# EAGLE design vusbtiny (EAGLE 6.4)
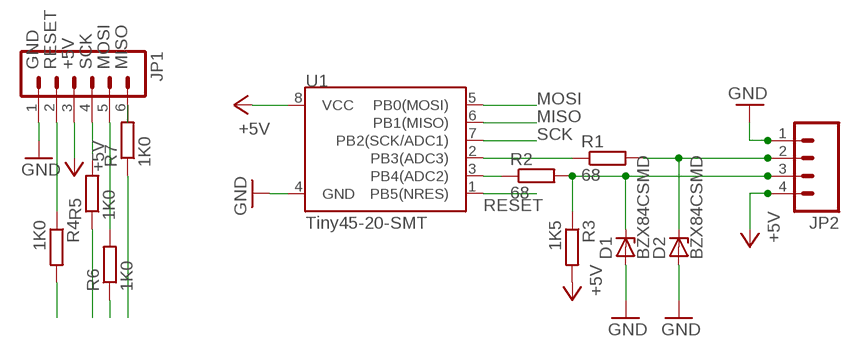
[diagram p0: schematic, sheet 1]

## Parts
D1  BZX84CSMD  [TO236]
D2  BZX84CSMD  [TO236]
JP1  M06LONGPADS  [1X06_LONGPADS]
JP2  M04LONGPADS  [1X04_LONGPADS]
R1  68  R-EU_R0805  [R0805]
R2  68  R-EU_R0805  [R0805]
R3  1K5  R-EU_R0805  [R0805]
R4  1K0  R-EU_R0805  [R0805]
R5  1K0  R-EU_R0805  [R0805]
R6  1K0  R-EU_R0805  [R0805]
R7  1K0  R-EU_R0805  [R0805]
U1  Tiny45-20-SMT  ATTINY45TINY45-20-SMT  [SO08-EIAJ]

## Nets
+5V: JP1.3 JP2.4 R3.2 U1.8(VCC)
GND: D1.A D2.A JP1.1 JP2.1 U1.4(GND)
MISO: R7.1 U1.6(PB1(MISO))
MOSI: R6.1 U1.5(PB0(MOSI))
N$1: R1.1 U1.2(PB3(ADC3))
N$2: R2.1 U1.3(PB4(ADC2))
N$3: D2.C JP2.2 R1.2
N$5: JP1.2 R4.1
N$6: JP1.4 R5.2
N$7: JP1.5 R6.2
N$8: JP1.6 R7.2
N$9: D1.C JP2.3 R2.2 R3.1
RESET: R4.2 U1.1(PB5(NRES))
SCK: R5.1 U1.7(PB2(SCK/ADC1))

## Library data of the parts
D1 D2 = diode:BZX84CSMD: Z DIODE
JP1 = SparkFun-Connectors:M06: Header 6 Standard 6-pin 0.1" header. Use with straight break away headers (SKU : PRT-00116), right angle break away headers (PRT-00553), swiss pins (PRT-00743), machine pins (PRT-00117), and female headers (PRT-00115). Molex polarized connector foot print use with SKU : PRT-08094 with associated crimp pins and housings. NOTES ON THE VARIANTS LOCK and LOCK_LONGPADS... This footprint was designed to help hold the alignment of a through-hole component (i.e. 6-pin header) while soldering it into place. You may notice that each hole has been shifted either up or down by 0.005 of an inch from it's more standard position (which is a perfectly straight line). This slight alteration caused the pins (the squares in the middle) to touch the edges of the holes. Because they are alternating, it causes a "brace" to hold the component in place. 0.005 has proven to be the perfect amount of "off-center" position when using our standard breakaway headers. Although looks a little odd when you look at the bare footprint, once you have a header in there, the alteration is very hard to notice. Also, if you push a header all the way into place, it is covered up entirely on the bottom side. This idea of altering the position of holes to aid alignment will be further integrated into the Sparkfun Library for other footprints. It can help hold any component with 3 or more connection pins.
JP2 = SparkFun-Connectors:M04: Header 4 Standard 4-pin 0.1" header. Use with straight break away headers (SKU : PRT-00116), right angle break away headers (PRT-00553), swiss pins (PRT-00743), machine pins (PRT-00117), and female headers (PRT-00115). Molex polarized connector foot print use with SKU : PRT-08231 with associated crimp pins and housings. 1MM SMD Version SKU: PRT-10208
R1-R7 = resistor:R-EU_: RESISTOR, European symbol
U1 = SparkFun-DigitalIC:ATTINY45: Atmel 8-pin 2/4/8kB flash uC; PROD_ID: IC-08922

## Board
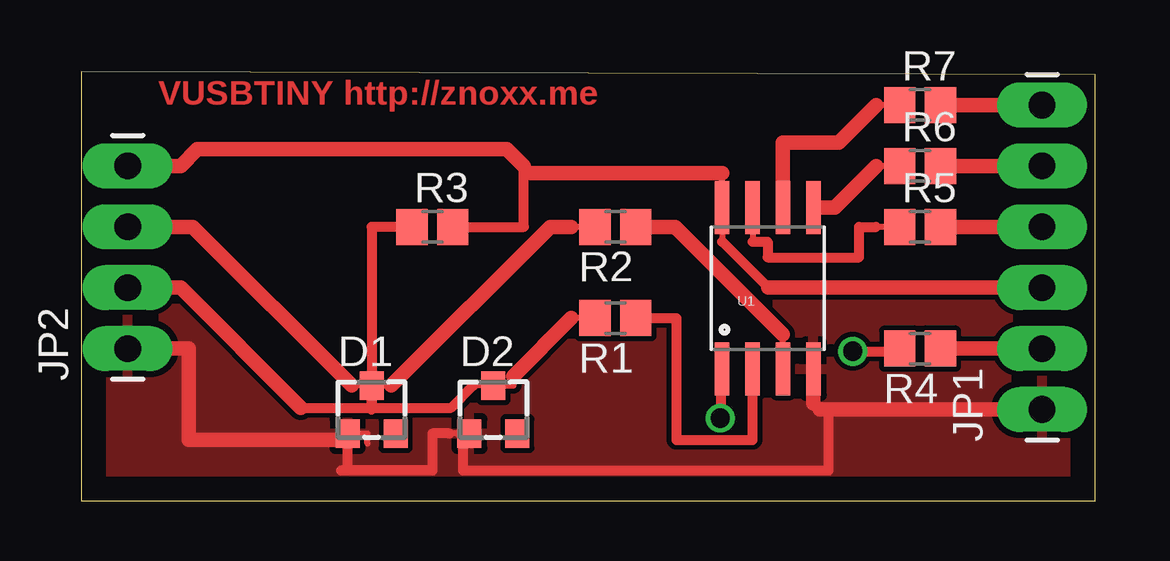
[diagram p1: board, top side]
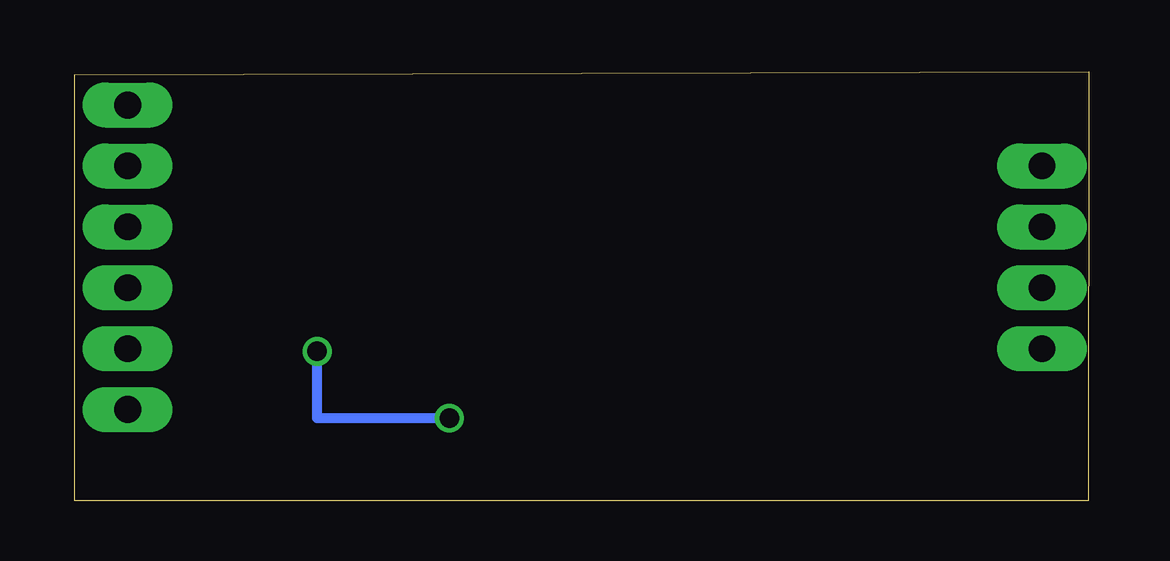
[diagram p2: board, bottom side, seen from below]

Size 42.25 x 17.9 mm. Coordinates in mm from the lower left corner, seen from the top.
Outline: 0.01,0 42.25,0 42.25,17.77 0,17.9 0.01,0
Copper layers (1*16): Top 0.035mm / dielectric 1.5mm / Bottom 0.035mm
Design rules "default": minimum track width 10mil, minimum drill 24mil, track to track 8mil, track to pad 8mil, pad to pad 8mil, via to via 8mil, smd to smd 8mil, copper to edge 40mil, drill to drill 8mil, minimum pad ring 10mil, minimum via ring 8mil, stop-mask expansion 4mil, vias tented up to drill 0mil, thermal gap 10mil

### Footprints (pad centres in the part's own frame; a part is rotated, then mirrored left to right if it is on the bottom)
TO236 = smd 1 x 1.2: A -1,-1; C 0,1; NC 1,-1
1X06_LONGPADS = drill 1.118 pad 1.88 long: 1 0,0; 2 2.54,0; 3 5.08,0; 4 7.62,0; 5 10.16,0; 6 12.7,0
1X04_LONGPADS = drill 1.118 pad 1.88 long: 1 0,0; 2 2.54,0; 3 5.08,0; 4 7.62,0
R0805 = smd 1.3 x 1.5: 1 -0.85,0; 2 0.85,0
SO08-EIAJ = smd 0.61 x 2.21: 1 -1.905,-3.378; 2 -0.635,-3.378; 3 0.635,-3.378; 4 1.905,-3.378; 5 1.905,3.353; 6 0.635,3.353; 7 -0.635,3.353; 8 -1.905,3.353

### Placement (x,y rotation side)
D1  12.1,3.81 0 top
D2  17.18,3.81 0 top
JP1  40.04,3.81 90 top
JP2  1.94,6.35 90 top
R1  22.26,7.62 180 top
R2  22.26,11.43 180 top
R3  14.64,11.43 0 top
R4  34.96,6.35 180 top
R5  34.96,11.43 0 top
R6  34.96,13.97 0 top
R7  34.96,16.51 0 top
U1  28.61,8.89 0 top

### Tracks (layer width: path | path; a pad name or v marks a point on that pad's centre or on a via)
+5V
  Top 0.254: 26.7,10.81 U1.8 26.7,12.96 26.7,13.68 | 18.73,13.68 18.44,13.96
  Top 0.406: 26.7,10.81 28.62,8.89 | R3.2 18.44,11.43 18.44,13.96
  Top 0.61: 28.62,8.89 JP1.3 | 26.7,13.68 18.73,13.68 | 18.44,13.96 17.74,14.67 4.84,14.67 4.15,13.97 JP2.4
GND
  Top 0.254: 15.35,2.81 15.76,2.81 D2.A | D1.A 11.93,2.81 11.93,2.39 | 30.78,3.81 30.51,4.08
  Top 0.406: 15.76,2.81 15.91,2.81 15.91,1.27 31.15,1.27 31.15,3.81 | 15.35,2.81 14.64,2.81 14.64,1.27 10.83,1.27 11.1,1.27 D1.A 11.1,2.54
  Top 0.61: U1.4 30.51,4.08 | JP1.1 31.15,3.81 30.78,3.81 | JP2.1 4.48,6.35 4.48,3.81 4.48,2.54 11.1,2.54
  pour Top: 0.67,17.78 41.31,17.78 41.31,0 0.68,0.49
MISO
  Top 0.254: R7.1 33.13,16.51
  Top 0.61: U1.6 29.24,14.95 31.56,14.95 33.13,16.51
MOSI
  Top 0.254: R6.1 33.13,13.97
  Top 0.61: U1.5 31.4,12.24 33.13,13.97
N$1
  Top 0.406: R1.1 24.8,7.62 24.8,2.54 27.34,2.54 27.97,2.54 U1.2
N$2
  Top 0.254: U1.3 29.24,6.95
  Top 0.61: 29.24,6.95 24.76,11.43 R2.1
N$3
  Top 0.254: R1.2 20.43,7.62 | 18.01,5.2 18.01,4.81 D2.C 16.35,4.81
  Top 0.406: 9.16,3.88 15.42,3.88 16.35,4.81
  Top 0.61: 20.43,7.62 18.01,5.2 | JP2.2 4.15,8.89 9.16,3.88
N$5
  Top 0.61: R4.1 JP1.2
N$6
  Top 0.61: R5.2 JP1.4
N$7
  Top 0.61: R6.2 JP1.5
N$8
  Top 0.61: R7.2 JP1.6
N$9
  Top 0.254: 12.93,4.81 D1.C 11.27,4.81 | 1.87,11.43 JP2.3 | R2.2 20.43,11.43
  Top 0.406: R3.1 12.1,11.43 12.1,6.35 12.1,3.81 D1.C
  Top 0.61: JP2.3 4.65,11.43 11.27,4.81 | 12.93,4.81 19.55,11.43 20.43,11.43
RESET  (via drill 0.8, 0.8 pad 0.81)
  Top 0.406: U1.1 v26.63,3.45 | v32.14,6.24 34.11,6.24 R4.2
  Bottom 0.406: v26.63,3.45 32.14,3.45 v32.14,6.24
SCK
  Top 0.254: R5.1 33.13,11.43 | U1.7 27.97,10.81
  Top 0.406: 27.97,10.81 28.61,10.81 28.61,10.16 32.42,10.16 32.42,11.43 33.13,11.43

### Text on the board
Top: VUSBTINY http://znoxx.me